# Altium schematic sheet RSL10_Sch.SchDoc
size 594 x 420 mm; CheckedBy: Нестеренко И.В.; Author: Митр Д.В.; SheetNumber: 1; SheetTotal: 2; DevelopedBy: Митр Д.В.
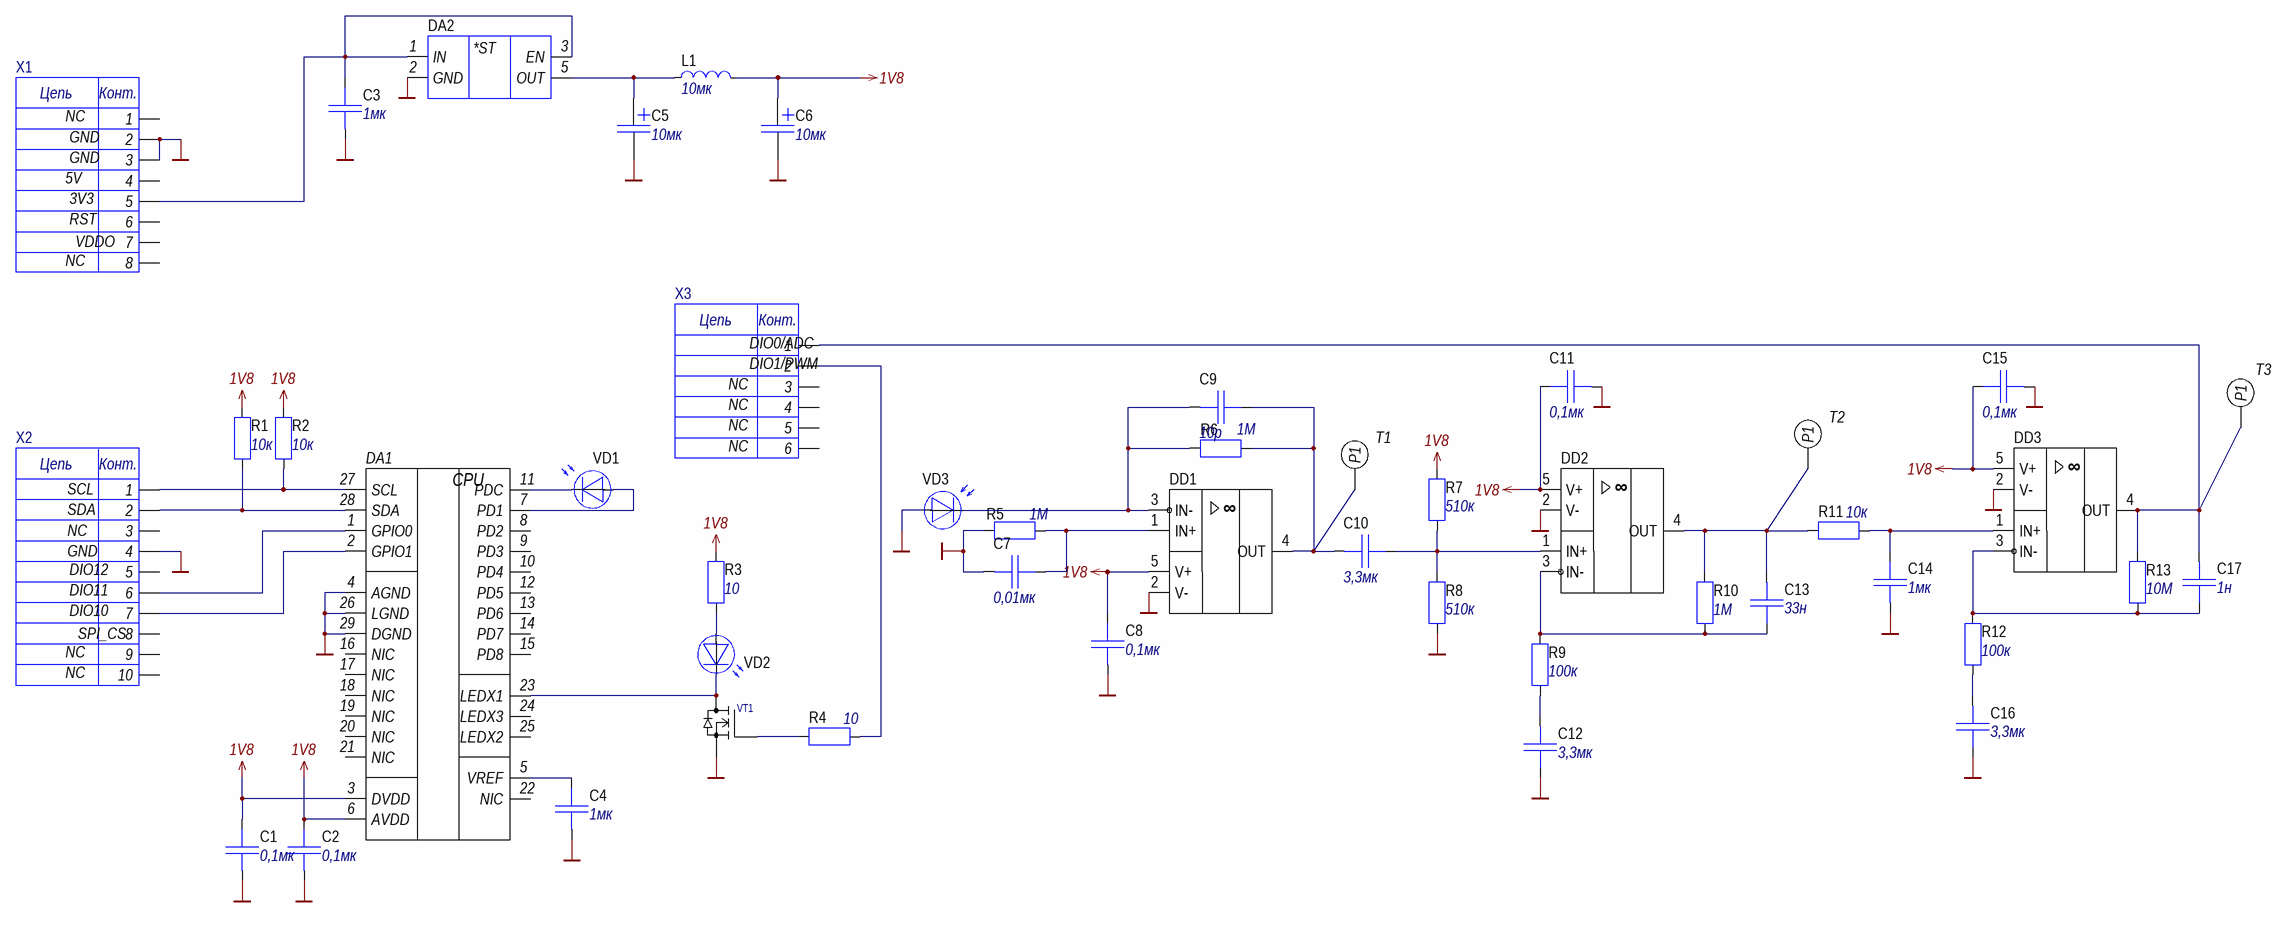
[diagram p0: RSL10_Sch.SchDoc]

## Parts
C1  0,1мк  [cap0603]
C2  0,1мк  [cap0603]
C3  1мк  [cap0603]
C4  1мк  [cap0603]
C5  10мк
C6  10мк
C7  0,01мк  [cap0603]
C8  0,1мк  [cap0603]
C9  10p  [cap0603]
C10  3,3мк  [cap0603]
C11  0,1мк  [cap0603]
C12  3,3мк  [cap0603]
C13  33н  [cap0603]
C14  1мк  [cap0603]
C15  0,1мк  [cap0603]
C16  3,3мк  [cap0603]
C17  1н  [cap0603]
DA1  ADPD1080  [ADPD1080]  (value not drawn)
DA2  (no value)  [TPS7A02]
DD1  operational amplifier_2  [OPA333]  (value not drawn)
DD2  operational amplifier_1  [OPA333]  (value not drawn)
DD3  operational amplifier_1  [OPA333]  (value not drawn)
L1  10мк  [MLZ1608M100WT000]
R1  10к  [Res0603]
R2  10к  [Res0603]
R3  10  [Res0603]
R4  10  [Res0603]
R5  1M  [Res0603]
R6  1M  [Res0603]
R7  510к  [Res0603]
R8  510к  [Res0603]
R9  100к  [Res0603]
R10  1М  [Res0603]
R11  10к  [Res0603]
R12  100к  [Res0603]
R13  10М  [Res0603]
T1  TestPoint  [TestPoint]  (value not drawn)
T2  TestPoint  [TestPoint]  (value not drawn)
T3  TestPoint  [TestPoint]  (value not drawn)
VD1  (no value)
VD2  (no value)  [LED1206]
VD3  (no value)
VT1  RU1J002YNTCL  [Mosfet]  (value not drawn)
X1  (no value)  [PSL_8]
X2  (no value)  [PSL_10]
X3  (no value)  [PSL_6]

## Nets
1V8: C1.2 C2.2 C6.1 C8.2 C11.2 C15.2 DA1.3(DVDD) DA1.6(AVDD) DD1.5(V+) DD2.5(V+) DD3.5(V+) L1.2 R1.1 R2.1 R3.2 R7.2
GND: C1.1 C2.1 C3.1 C4.1 C5.2 C6.2 C7.1 C8.1 C11.1 C12.2 C14.1 C15.1 C16.2 DA1.4(AGND) DA1.26(LGND) DA1.29(DGND) DA2.2(GND) DD1.2(V-) DD2.2(V-) DD3.2(V-) R5.1 R8.1 VD3.1 VT1.2(S) X1.2 X1.3 X2.4
NetC3_2: C3.2 DA2.1(IN) DA2.3(EN) X1.5
NetC4_2: C4.2 DA1.5(VREF)
NetC5_1: C5.1 DA2.5(OUT) L1.1
NetC7_2: C7.2 DD1.1(IN+) R5.2
NetC9_1: C9.1 DD1.3(IN-) R6.1 VD3.2
NetC9_2: C9.2 C10.1 DD1.4(OUT) R6.2 T1.T(P1)
NetC10_2: C10.2 DD2.1(IN+) R7.1 R8.2
NetC12_1: C12.1 R9.2
NetC13_1: C13.1 DD2.4(OUT) R10.1 R11.2 T2.T(P1)
NetC13_2: C13.2 DD2.3(IN-) R9.1 R10.2
NetC14_2: C14.2 DD3.1(IN+) R11.1
NetC16_1: C16.1 R12.2
NetC17_1: C17.1 DD3.4(OUT) R13.1 T3.T(P1) X3.1
NetC17_2: C17.2 DD3.3(IN-) R12.1 R13.2
NetDA1_1: DA1.1(GPIO0) X2.6
NetDA1_2: DA1.2(GPIO1) X2.7
NetDA1_7: DA1.7(PD1) VD1.1
NetDA1_11: DA1.11(PDC) VD1.2
NetDA1_23: DA1.23(LEDX1) VD2.K VT1.3(D)
NetDA1_27: DA1.27(SCL) R2.2 X2.1
NetDA1_28: DA1.28(SDA) R1.2 X2.2
NetR3_1: R3.1 VD2.A
NetR4_1: R4.1 VT1.1(G)
NetR4_2: R4.2 X3.2

Not connected (* = marked no-connect by the designer): DA1 8(PD2) 9(PD3) 10(PD4) 12(PD5) 13(PD6) 14(PD7) 15(PD8) 16(NIC) 17(NIC) 18(NIC) 19(NIC) 20(NIC) 21(NIC) 22(NIC) 24(LEDX3) 25(LEDX2); X1 1 4 6 7 8; X2 3 5 8 9 10; X3 3 4 5 6

## Notes on the sheet
- Перв. примен.
- Справ. №
- Подп. дата
- Инв. № дубл.
- Взам. инв. №
- Подп. и дата
- Изм.
- Разраб.
- Лист
- № докум.
- Подп.
- Дата
- Лит.
- Масса
- Масштаб
- Пров.
- Т.контр.
- Листов
- Инв. № подл.
- Н.контр.
- Утв.
- ALTIUM GOSTBOM2.0 KEV
- Файл:
- Копировал
- Формат А2
- (in symbol ADPD1080) CPU
- (in symbol LDO) *ST
- (in symbol operational amplifier_1) ∞
- (in symbol operational amplifier_2) ∞
- (in symbol PSL6) Цепь; Конт.; DIO0/ADC; DIO1/PWM; NC
- (in symbol PSL8) Цепь; Конт.; NC; GND; 5V; 3V3; RST; VDDO
- (in symbol PSL10) Цепь; Конт.; SCL; SDA; NC; GND; DIO12; DIO11; DIO10; SPI_CS

## Library data of the parts
C1 = CapCer: Керамический конденсатор; manufacture: ОЖО.460.107ТУ; name_main: CC0603KRX7R7BB104; Units: Ф; Name: Керамический конденсатор; Value: 0,1мк
C2 C8 C11 C15 = CapCer: Керамический конденсатор; manufacture: ОЖО.460.107ТУ; nameSuf: -3; name_main: CC0603KRX7R7BB104; Units: Ф; Name: Керамический конденсатор; Value: 0,1мк
C3 C4 C14 = CapCer: Керамический конденсатор; manufacture: ОЖО.460.107ТУ; nameSuf: -3; name_main: CC0603KRX7R7BB105; Units: Ф; Name: Керамический конденсатор; Value: 1мк
C5 C6 = CapTan: Танталовый конденсатор; manufacture: АЖЯР.673546.004ТУ; name_main: 293D106X9016B2TE3; Units: Ф; Footpr: "E"; Name: Танталовый конденсатор; Value: 10мк
C7 = CapCer: Керамический конденсатор; manufacture: ОЖО.460.107ТУ; name_main: GRM188R71H103K; Units: Ф; Name: Керамический конденсатор; Value: 0,01мк
C9 = CapCer: Керамический конденсатор; manufacture: ОЖО.460.107ТУ; name_main: CL10C100JB8NNNC; Units: Ф; Name: Керамический конденсатор; Value: 10p
C10 C12 C16 = CapCer: Керамический конденсатор; manufacture: ОЖО.460.107ТУ; name_main: GRM21BR60J335K; Units: Ф; Name: Керамический конденсатор; Value: 3,3мк
C13 = CapCer: Керамический конденсатор; manufacture: ОЖО.460.107ТУ; nameSuf: -3; name_main: CC0603KRX7R7BB333; Units: Ф; Name: Керамический конденсатор; Value: 33н
C17 = CapCer: Керамический конденсатор; manufacture: ОЖО.460.107ТУ; name_main: GRM188R61C105K; Units: Ф; Name: Керамический конденсатор; Value: 1н
DA2 = LDO: name: Микросхема; name_main: TPS7A0218PDBVR
DD1 = operational amplifier_2: Операционный усилитель; name_main: OPA333AIDBVR
DD2 DD3 = operational amplifier_1: Операционный усилитель; name_main: OPA333AIDBVR
L1 = Ind: Катушка индуктивности; Units: Гн; Name: Катушка индуктивности; name_main: MLZ1608M100WT000; Value: 10мк
R1 R2 R11 = Res: Резистор; Manufacturer: АЛЯР.434110.005ТУ; Tolerance: 5%; name_main: RC0603FR-0710KL; Name: Резистор; Value: 10к
R3 R4 = Res: Резистор; Tolerance: 5%; name_main: RC0603JR-0710RL; Name: Резистор; Value: 10
R5 R10 = Res: Резистор; Tolerance: 1%; name_main: RC0603FR-071ML; Name: Резистор
  R5: Value: 1M
  R10: Value: 1М
R6 = Res: Резистор; name_main: RC0603FR-071ML; Name: Резистор; Value: 1M
R7 R8 = Res: Резистор; name_main: RC0603FR-07510KL; Name: Резистор; Value: 510к
R9 R12 = Res: Резистор; name_main: RC0603FR-07100KL; Name: Резистор; Value: 100к
R13 = Res: Резистор; name_main: RC0603FR-0710ML; Name: Резистор; Value: 10М
VD1 VD3 = Photodiode: Name: Детектор; Name_main: SFH 2703
VD2 = Led: Излучатель; manufacture: аА0.339.189ТУ; Name: Индикатор; Name_main: 15412094A9000
VT1 = RU1J002YNTCL: N-MOSFET DirectFET SQ
X1 = PSL8: manufacture: БСАР.430420.014ТУ; name: Разъемы; name_main: PLS-8
X2 = PSL10: manufacture: БСАР.430420.014ТУ; name: Разъемы; name_main: PLS-10
X3 = PSL6: manufacture: БСАР.430420.014ТУ; name: Разъемы; name_main: PLS-6